# EAGLE design CAN Mirror (EAGLE 6.2)

## Sheet 1 of 4: Processor
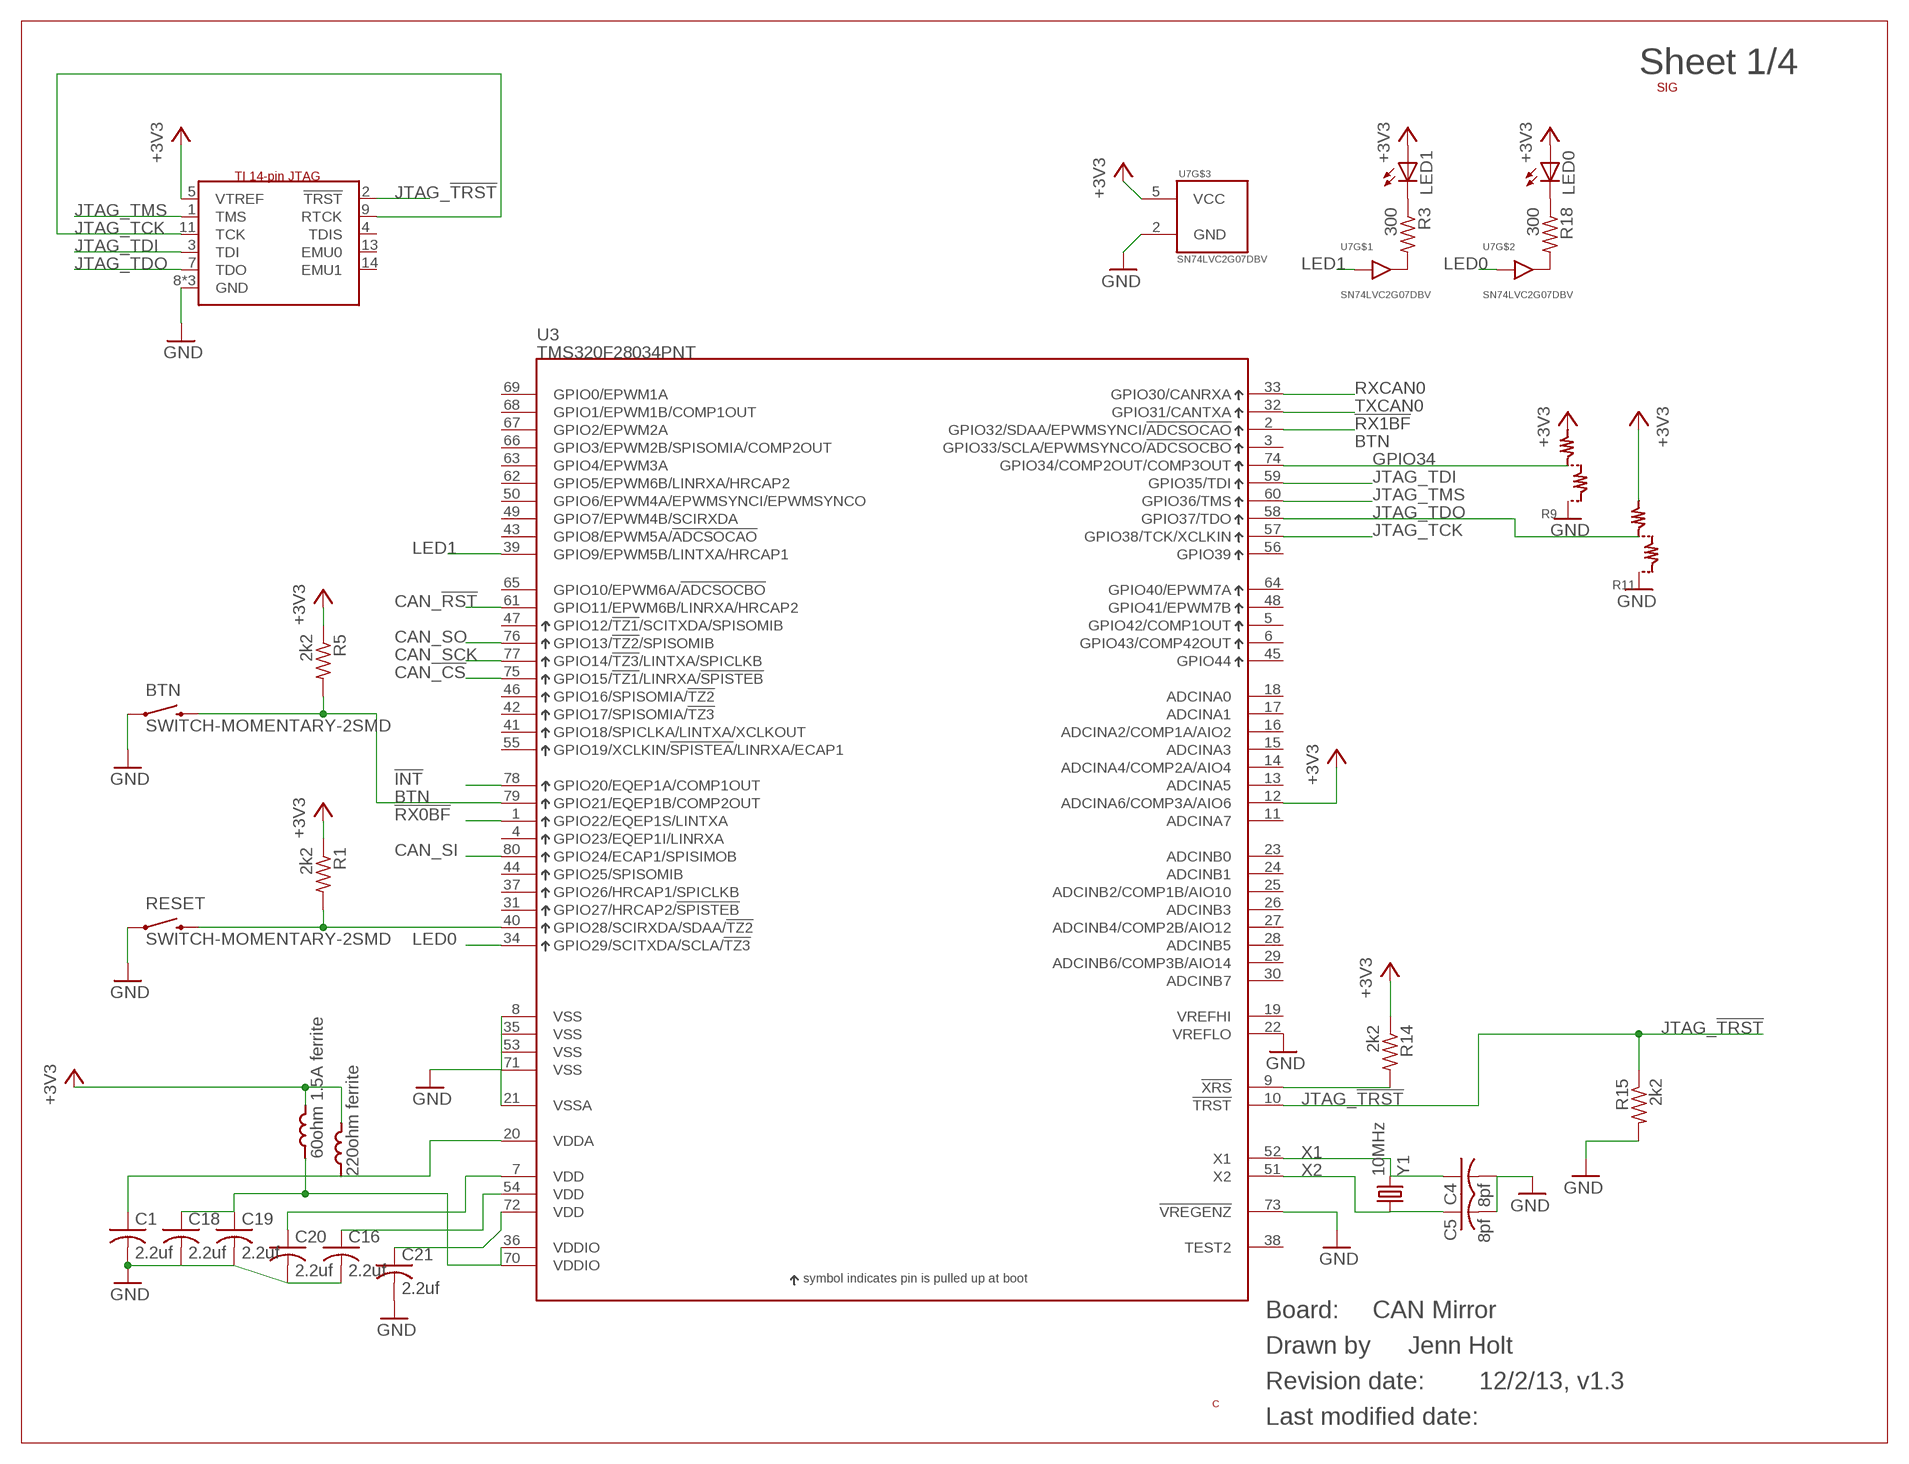
[diagram p0: schematic, sheet 1]

### Parts
BTN  SWITCH-MOMENTARY-2SMD  [TACTILE_SWITCH_SMD]
C1  2.2uf  C-USC0603  [C0603]
C4  8pf  C-USC0603  [C0603]
C5  8pf  C-USC0603  [C0603]
C16  2.2uf  C-USC0603  [C0603]
C18  2.2uf  C-USC0603  [C0603]
C19  2.2uf  C-USC0603  [C0603]
C20  2.2uf  C-USC0603  [C0603]
C21  2.2uf  C-USC0603  [C0603]
L1  60ohm 1.5A ferrite  INDUCTOR_CERAMIC  [R0603]
L2  220ohm ferrite  INDUCTOR_CERAMIC  [R0603]
LED0  LED0603  [LED-0603]
LED1  LED0603  [LED-0603]
R1  2k2  R-US_R0603  [R0603]
R3  300  R-US_R0603  [R0603]
R5  2k2  R-US_R0603  [R0603]
R9  0402-JUMPER-3WAY-0603  [0603-JUMPER-3WAY]
R11  0402-JUMPER-3WAY-0603  [0603-JUMPER-3WAY]
R14  2k2  R-US_R0603  [R0603]
R15  2k2  R-US_R0603  [R0603]
R18  300  R-US_R0603  [R0603]
RESET  SWITCH-MOMENTARY-2SMD  [TACTILE_SWITCH_SMD]
U3  TMS320F28034PNT  [PQFP-80_(S-PQFP-G80)]
U7  SN74LVC2G07DBV  [SOT-6_DDC]
U$1  CURRENT-LOGO-0.5"  [CURRENT-0.5"]
U$6  TI_JTAG14  [PAK100/2500-14]
U$9  CURRENT-FRAME-LETTER-LANDSCAPE  [BLANK]
U$20  SIG  [SIG]
Y1  10MHz  CRYSTAL5X3  [CRYSTAL-SMD-5X3]

### Nets
!INT: U3.78(GPIO20/EQEP1A/COMP1OUT) ; also sheet 3
!RX0BF: U3.1(GPIO22/EQEP1S/LINTXA) ; also sheet 3
!RX1BF: U3.2(GPIO32/SDAA/EPWMSYNCI/!ADCSOCAO) ; also sheet 3
!XRS: R14.2 U3.9(!XRS)
+3V3: L1.2 L2.2 LED0.A LED1.A R1.1 R5.1 R9.B R11.B R14.1 U3.12(ADCINA6/COMP3A/AIO6) U7.5(VCC) U$6.5(VTREF) ; also sheet 2,3,4
BTN: BTN.3 R5.2 U3.79(GPIO21/EQEP1B/COMP2OUT)
CAN_!CS: U3.75(GPIO15/!TZ1!/LINRXA/!SPISTEB) ; also sheet 3
CAN_!RST: U3.61(GPIO11/EPWM6B/LINRXA/HRCAP2) ; also sheet 3
CAN_SCK: U3.77(GPIO14/!TZ3!/LINTXA/SPICLKB) ; also sheet 3
CAN_SI: U3.80(GPIO24/ECAP1/SPISIMOB) ; also sheet 3
CAN_SO: U3.76(GPIO13/!TZ2!/SPISOMIB) ; also sheet 3
GND: BTN.1 C1.2 C4.2 C5.2 C16.2 C18.2 C19.2 C20.2 C21.2 R9.C R11.C R15.2 RESET.1 U3.8(VSS) U3.21(VSSA) U3.22(VREFLO) U3.35(VSS) U3.53(VSS) U3.71(VSS) U3.73(!VREGENZ) U7.2(GND) U$6.8(GND) U$6.10(GND) U$6.12(GND) ; also sheet 2,3,4
GPIO34: R9.A U3.74(GPIO34/COMP2OUT/COMP3OUT)
JTAG_!TRST: R15.1 U3.10(!TRST) U$6.2(!TRST)
JTAG_TCK: U3.57(GPIO38/TCK/XCLKIN) U$6.9(RTCK) U$6.11(TCK)
JTAG_TDI: U3.59(GPIO35/TDI) U$6.3(TDI)
JTAG_TDO: R11.A U3.58(GPIO37/TDO) U$6.7(TDO)
JTAG_TMS: U3.60(GPIO36/TMS) U$6.1(TMS)
LED0: U3.34(GPIO29/SCITXDA/SCLA/!TZ3) U7.3(A)
LED1: U3.39(GPIO9/EPWM5B/LINTXA/HRCAP1) U7.1(A)
N$6: C1.1 L2.1 U3.20(VDDA)
N$7: R18.2 U7.4(Y)
N$9: R3.2 U7.6(Y)
N$13: C18.1 C19.1 L1.1 U3.36(VDDIO) U3.70(VDDIO)
N$14: R1.2 RESET.3 U3.40(GPIO28/SCIRXDA/SDAA/!TZ2)
N$19: C16.1 U3.54(VDD)
N$20: C20.1 U3.7(VDD)
N$21: C21.1 U3.72(VDD)
N$22: LED1.C R3.1
N$27: LED0.C R18.1
RXCAN0: U3.33(GPIO30/CANRXA) ; also sheet 3
TXCAN0: U3.32(GPIO31/CANTXA) ; also sheet 3
X1: C4.1 U3.52(X1) Y1.3
X2: C5.1 U3.51(X2) Y1.1
Unconnected: U3.3(GPIO33/SCLA/EPWMSYNCO/!ADCSOCBO) U3.4(GPIO23/EQEP1I/LINRXA) U3.5(GPIO42/COMP1OUT) U3.6(GPIO43/COMP42OUT) U3.11(ADCINA7) U3.13(ADCINA5) U3.14(ADCINA4/COMP2A/AIO4) U3.15(ADCINA3) U3.16(ADCINA2/COMP1A/AIO2) U3.17(ADCINA1) U3.18(ADCINA0) U3.19(VREFHI) U3.23(ADCINB0) U3.24(ADCINB1) U3.25(ADCINB2/COMP1B/AIO10) U3.26(ADCINB3) U3.27(ADCINB4/COMP2B/AIO12) U3.28(ADCINB5) U3.29(ADCINB6/COMP3B/AIO14) U3.30(ADCINB7) U3.31(GPIO27/HRCAP2/!SPISTEB) U3.37(GPIO26/HRCAP1/SPICLKB) U3.38(TEST2) U3.41(GPIO18/SPICLKA/LINTXA/XCLKOUT) U3.42(GPIO17/SPISOMIA/!TZ3) U3.43(GPIO8/EPWM5A/!ADCSOCAO) U3.44(GPIO25/SPISOMIB) U3.45(GPIO44) U3.46(GPIO16/SPISOMIA/!TZ2) U3.47(GPIO12/!TZ1!/SCITXDA/SPISOMIB) U3.48(GPIO41/EPWM7B) U3.49(GPIO7/EPWM4B/SCIRXDA) U3.50(GPIO6/EPWM4A/EPWMSYNCI/EPWMSYNCO) U3.55(GPIO19/XCLKIN/!SPISTEA!/LINRXA/ECAP1) U3.56(GPIO39) U3.62(GPIO5/EPWM6B/LINRXA/HRCAP2) U3.63(GPIO4/EPWM3A) U3.64(GPIO40/EPWM7A) U3.65(GPIO10/EPWM6A/!ADCSOCBO) U3.66(GPIO3/EPWM2B/SPISOMIA/COMP2OUT) U3.67(GPIO2/EPWM2A) U3.68(GPIO1/EPWM1B/COMP1OUT) U3.69(GPIO0/EPWM1A) U$6.4(TDIS) U$6.13(EMU0) U$6.14(EMU1)

### Notes on the sheet
- CAN Mirror
- Jenn Holt
- 12/2/13, v1.3

## Sheet 2 of 4: Connectors
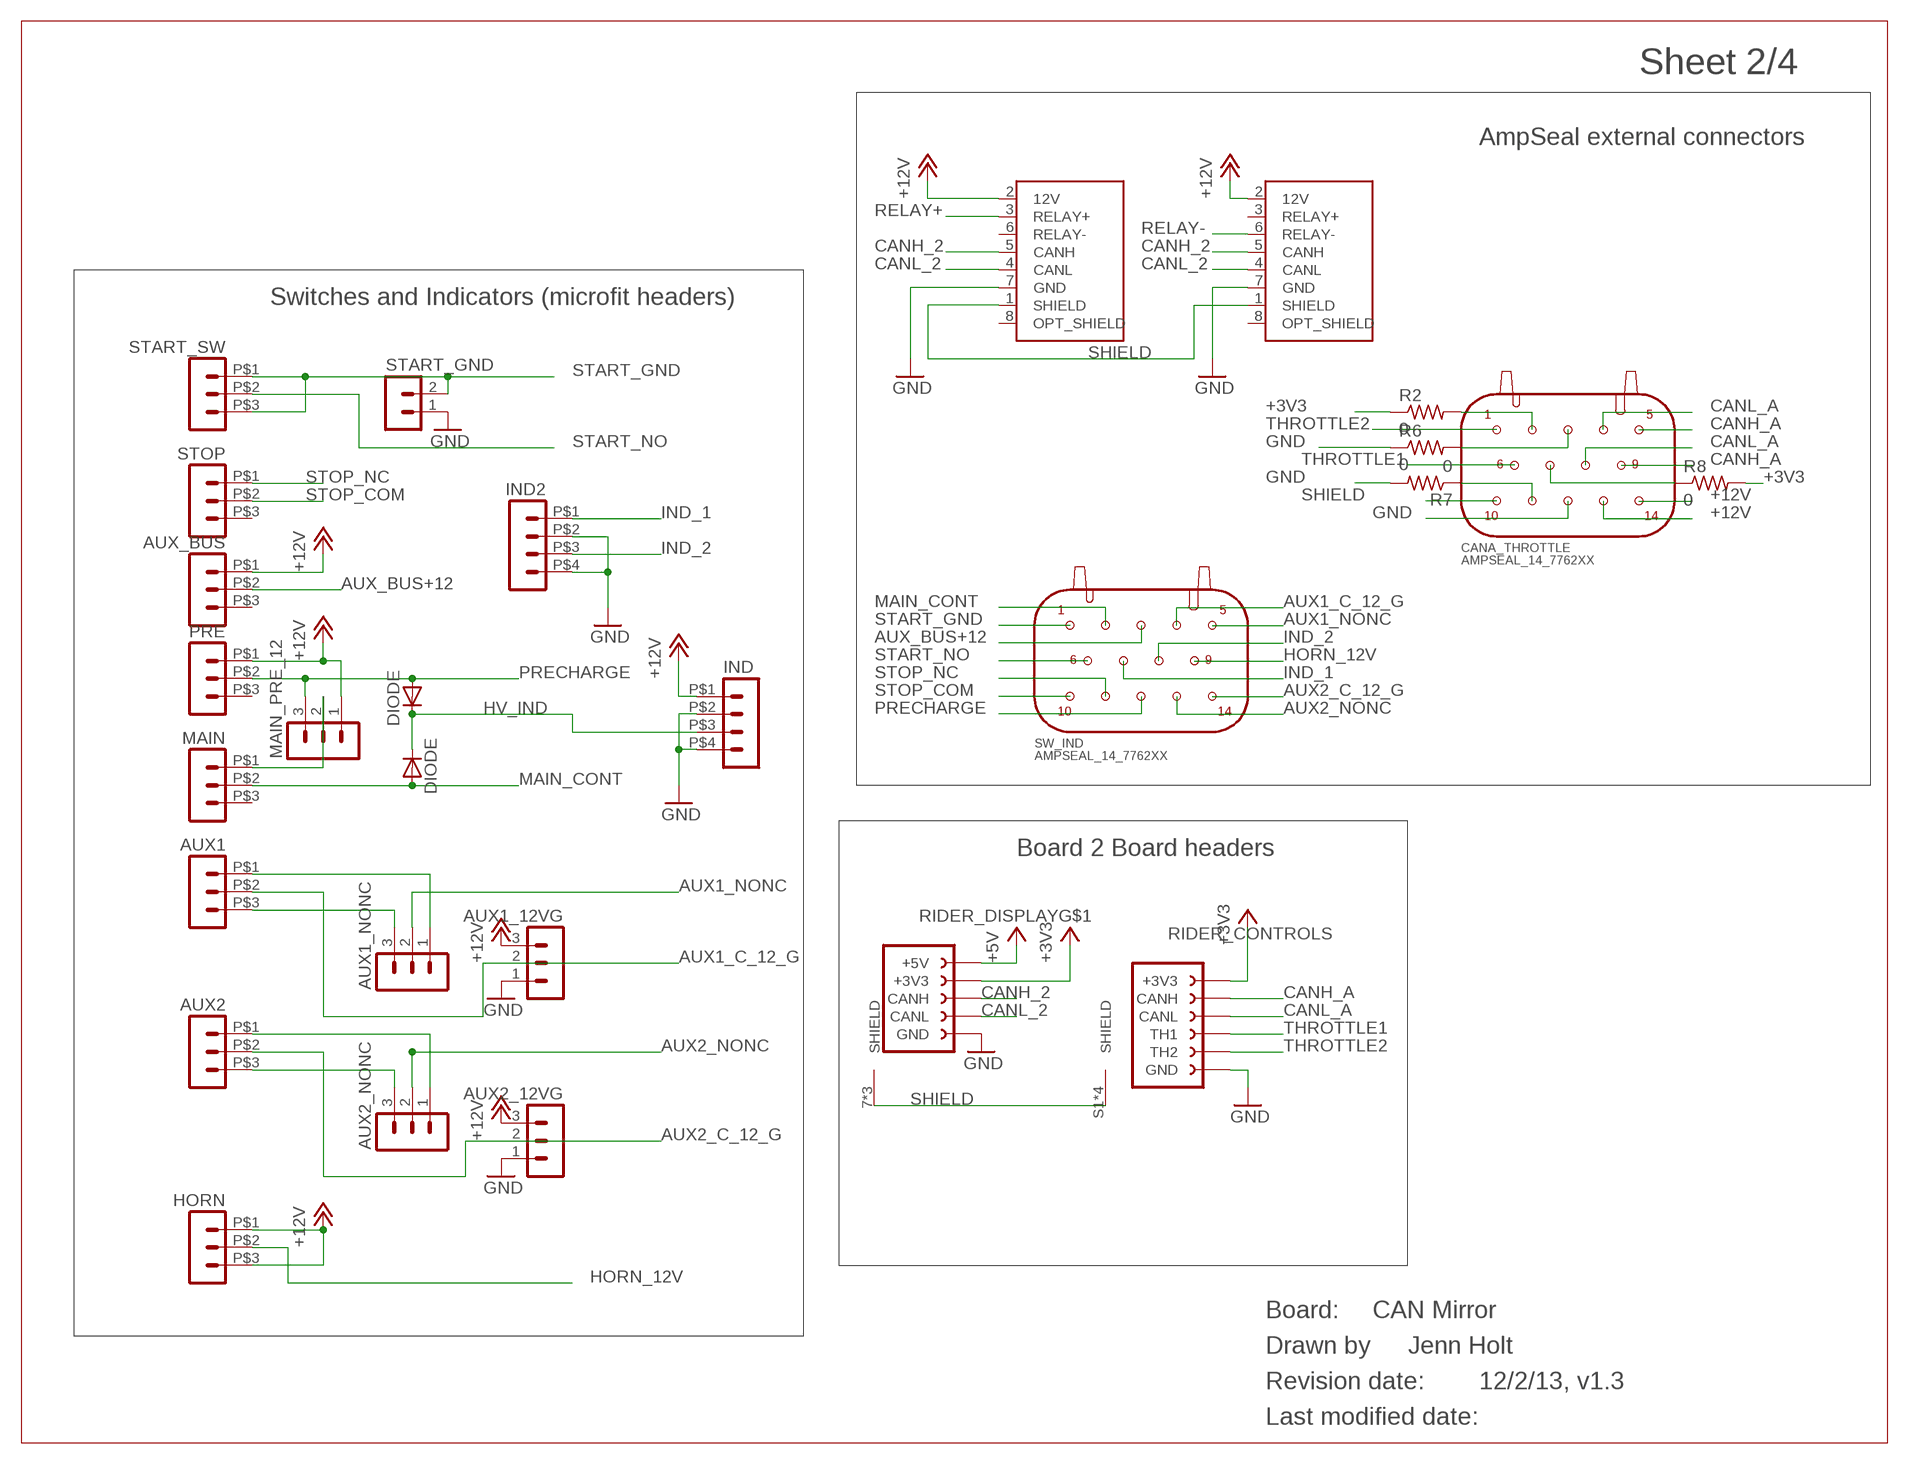
[diagram p1: schematic, sheet 2]

### Parts
AUX1  HEADER_POS3_43650-0321  [43650-0321]
AUX1_12VG  MA03-1  [MA03-1]
AUX1_NONC  MA03-1  [MA03-1]
AUX2  HEADER_POS3_43650-0321  [43650-0321]
AUX2_12VG  MA03-1  [MA03-1]
AUX2_NONC  MA03-1  [MA03-1]
AUX_BUS  HEADER_POS3_43650-0321  [43650-0321]
CANA_THROTTLE  AMPSEAL_14_7762XX  [776262-1_AMPSEAL_14_VERT]
D1  DIODE  [SOD-123]
D5  DIODE  [SOD-123]
HORN  HEADER_POS3_43650-0321  [43650-0321]
IND  HEADER_POS4_43045-0415  [43045-0415]
IND2  HEADER_POS4_43045-0415  [43045-0415]
MAIN  HEADER_POS3_43650-0321  [43650-0321]
MAIN_PRE_12  MA03-1  [MA03-1]
PRE  HEADER_POS3_43650-0321  [43650-0321]
R2  0  R-US_R0603  [R0603]
R6  0  R-US_R0603  [R0603]
R7  0  R-US_R0603  [R0603]
R8  0  R-US_R0603  [R0603]
RIDER_CONTROLS  RIDER_CONTROLS  [RIDER_CONTROLS]
RIDER_DISPLAY  RIDER_DISPLAY  [DISPLAY_BOARD]
START_GND  MA02-1  [MA02-1]
START_SW  HEADER_POS3_43650-0321  [43650-0321]
STOP  HEADER_POS3_43650-0321  [43650-0321]
SW_IND  AMPSEAL_14_7762XX  [776262-1_AMPSEAL_14_VERT]
U$12  CURRENT-FRAME-LETTER-LANDSCAPE  [BLANK]
U$13  CANBUS2VERT  [776276-1_AMPSEAL_8_VERT]
U$14  CANBUS2VERT  [776276-1_AMPSEAL_8_VERT]

### Nets
+3V3: R2.1 R8.2 RIDER_CONTROLS.6(+3V3) RIDER_DISPLAY.2(+3V3) ; also sheet 1,3,4
+5V: RIDER_DISPLAY.1(+5V) ; also sheet 4
+12V: AUX1_12VG.3 AUX2_12VG.3 AUX_BUS.P$1 CANA_THROTTLE.13 CANA_THROTTLE.14 HORN.P$1 HORN.P$3 IND.P$1 MAIN_PRE_12.1 PRE.P$1 U$13.2(12V) U$14.2(12V) ; also sheet 4
AUX1_C_12_G: AUX1.P$2 AUX1_12VG.2 SW_IND.4
AUX1_NONC: AUX1_NONC.2 SW_IND.5
AUX2_C_12_G: AUX2.P$2 AUX2_12VG.2 SW_IND.14
AUX2_NONC: AUX2_NONC.2 SW_IND.13
AUX_BUS+12: AUX_BUS.P$2 SW_IND.3
CANH_2: RIDER_DISPLAY.4(CANH) U$13.5(CANH) U$14.5(CANH) ; also sheet 3
CANH_A: CANA_THROTTLE.5 CANA_THROTTLE.9 RIDER_CONTROLS.5(CANH) ; also sheet 3
CANL_2: RIDER_DISPLAY.3(CANL) U$13.4(CANL) U$14.4(CANL) ; also sheet 3
CANL_A: CANA_THROTTLE.4 CANA_THROTTLE.8 RIDER_CONTROLS.4(CANL) ; also sheet 3
GND: AUX1_12VG.1 AUX2_12VG.1 CANA_THROTTLE.12 IND2.P$2 IND2.P$4 IND.P$2 IND.P$4 R6.1 R7.2 RIDER_CONTROLS.1(GND) RIDER_DISPLAY.5(GND) RIDER_DISPLAY.6(GND) START_GND.1 U$13.7(GND) U$14.7(GND) ; also sheet 1,3,4
HORN_12V: HORN.P$2 SW_IND.9
HV_IND: D1.C D5.C IND.P$3
IND_1: IND2.P$1 SW_IND.7
IND_2: IND2.P$3 SW_IND.8
MAIN_CONT: D5.A MAIN.P$2 SW_IND.2
N$3: AUX1.P$1 AUX1_NONC.1
N$5: AUX1.P$3 AUX1_NONC.3
N$8: AUX2.P$1 AUX2_NONC.1
N$10: AUX2.P$3 AUX2_NONC.3
N$12: MAIN.P$1 MAIN_PRE_12.2
N$15: CANA_THROTTLE.2 R2.2
N$16: CANA_THROTTLE.3 R6.2
N$17: CANA_THROTTLE.11 R7.1
N$18: CANA_THROTTLE.7 R8.1
PRECHARGE: D1.A MAIN_PRE_12.3 PRE.P$2 SW_IND.12
RELAY+: U$13.3(RELAY+) ; also sheet 3
RELAY-: U$14.6(RELAY-) ; also sheet 3
SHIELD: CANA_THROTTLE.10 RIDER_CONTROLS.S1(SHIELD) RIDER_CONTROLS.S2(SHIELD) RIDER_CONTROLS.S3(SHIELD) RIDER_CONTROLS.S4(SHIELD) RIDER_DISPLAY.7(SHIELD) RIDER_DISPLAY.8(SHIELD) RIDER_DISPLAY.9(SHIELD) U$13.1(SHIELD) U$14.1(SHIELD) ; also sheet 4
START_GND: START_GND.2 START_SW.P$1 START_SW.P$3 SW_IND.1
START_NO: START_SW.P$2 SW_IND.6
STOP_COM: STOP.P$2 SW_IND.10
STOP_NC: STOP.P$1 SW_IND.11
THROTTLE1: CANA_THROTTLE.6 RIDER_CONTROLS.3(TH1)
THROTTLE2: CANA_THROTTLE.1 RIDER_CONTROLS.2(TH2)
Unconnected: AUX_BUS.P$3 MAIN.P$3 PRE.P$3 STOP.P$3 U$13.6(RELAY-) U$13.8(OPT_SHIELD) U$14.3(RELAY+) U$14.8(OPT_SHIELD)

### Notes on the sheet
- AmpSeal external connectors
- Switches and Indicators (microfit headers)
- Board 2 Board headers
- CAN Mirror
- Jenn Holt
- 12/2/13, v1.3

## Sheet 3 of 4: CAN tranceivers
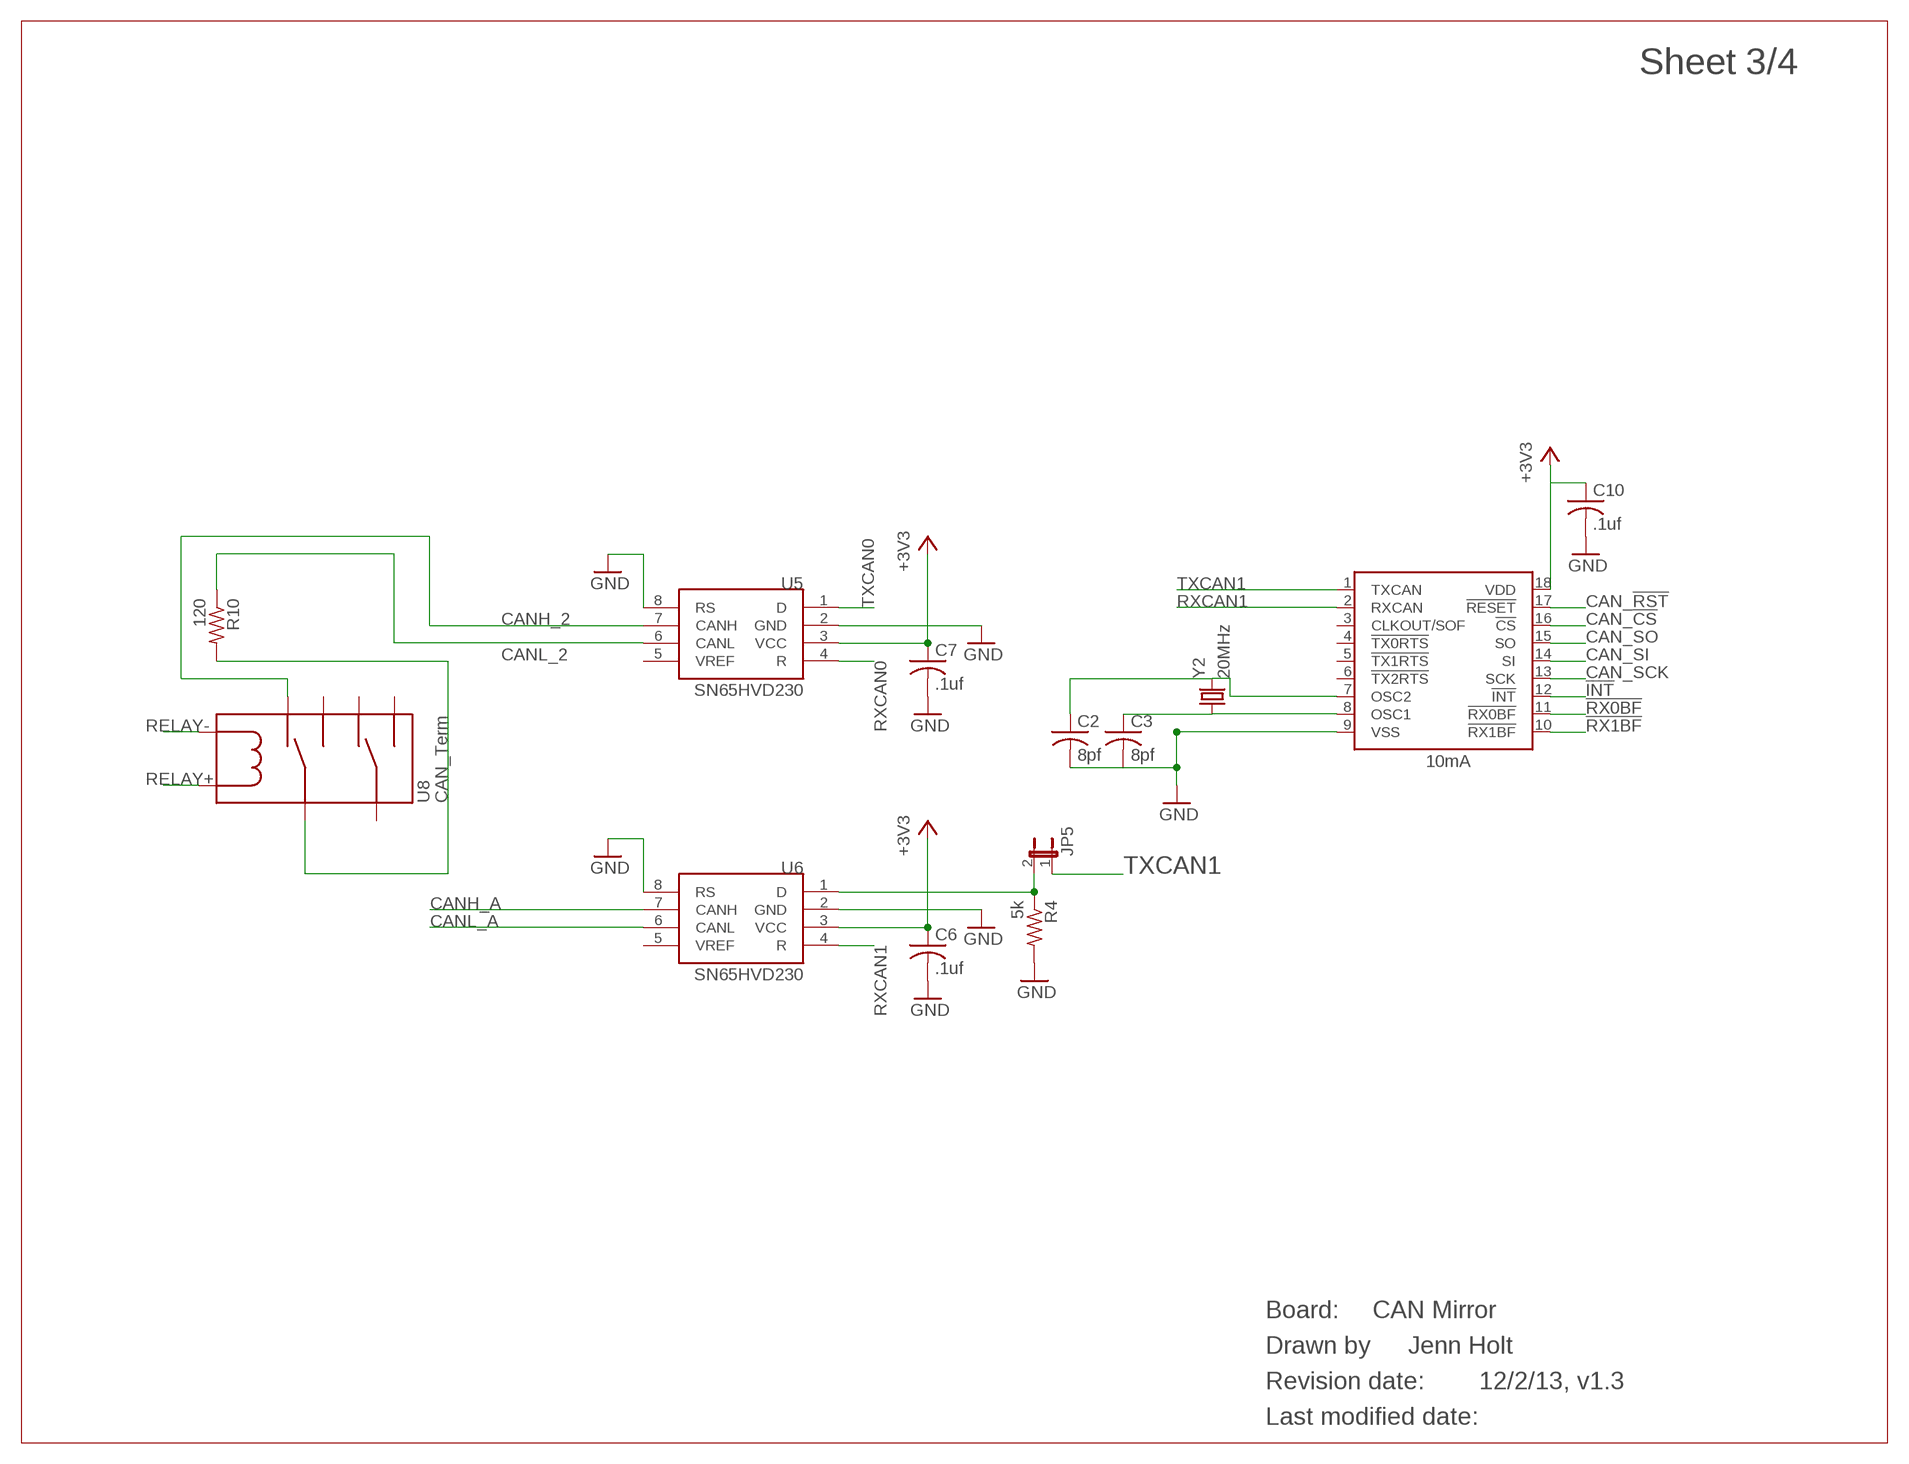
[diagram p2: schematic, sheet 3]

### Parts
C2  8pf  C-USC0603  [C0603]
C3  8pf  C-USC0603  [C0603]
C6  .1uf  C-USC0603  [C0603]
C7  .1uf  C-USC0603  [C0603]
C10  .1uf  C-USC0603  [C0603]
JP5  JUMPER-2SMD-NO  [SJ_2S-NO]
R4  5k  R-US_R0603  [R0603]
R10  120  R-US_R0603  [R0603]
U4  MCP2515  [SO-18W]
U5  SN65HVD230  [SOIC8]
U6  SN65HVD230  [SOIC8]
U8  CAN_Term  IM_RELAY  [IM_RELAY]
U$16  CURRENT-FRAME-LETTER-LANDSCAPE  [BLANK]
Y2  20MHz  CRYSTAL5X3  [CRYSTAL-SMD-5X3]

### Nets
!INT: U4.12(!INT) ; also sheet 1
!RX0BF: U4.11(!RX0BF) ; also sheet 1
!RX1BF: U4.10(!RX1BF) ; also sheet 1
+3V3: C6.1 C7.1 C10.1 U4.18(VDD) U5.3(VCC) U6.3(VCC) ; also sheet 1,2,4
CAN_!CS: U4.16(!CS) ; also sheet 1
CAN_!RST: U4.17(!RESET) ; also sheet 1
CAN_SCK: U4.13(SCK) ; also sheet 1
CAN_SI: U4.14(SI) ; also sheet 1
CAN_SO: U4.15(SO) ; also sheet 1
CANH_2: U5.7(CANH) U8.2(NC1) ; also sheet 2
CANH_A: U6.7(CANH) ; also sheet 2
CANL_2: R10.1 U5.6(CANL) ; also sheet 2
CANL_A: U6.6(CANL) ; also sheet 2
GND: C2.2 C3.2 C6.2 C7.2 C10.2 R4.2 U4.9(VSS) U5.2(GND) U5.8(RS) U6.2(GND) U6.8(RS) ; also sheet 1,2,4
N$1: C3.1 U4.8(OSC1) Y2.1
N$2: C2.1 U4.7(OSC2) Y2.3
N$4: JP5.2 R4.1 U6.1(D)
N$11: R10.2 U8.3(COM1)
RELAY+: U8.1(C1) ; also sheet 2
RELAY-: U8.8(C2) ; also sheet 2
RXCAN0: U5.4(R) ; also sheet 1
RXCAN1: U4.2(RXCAN) U6.4(R)
TXCAN0: U5.1(D) ; also sheet 1
TXCAN1: JP5.1 U4.1(TXCAN)
Unconnected: U4.3(CLKOUT/SOF) U4.4(!TX0RTS) U4.5(!TX1RTS) U4.6(!TX2RTS) U5.5(VREF) U6.5(VREF) U8.4(NO1) U8.5(NO2) U8.6(COM2) U8.7(NC2)

### Notes on the sheet
- 10mA
- CAN Mirror
- Jenn Holt
- 12/2/13, v1.3

## Sheet 4 of 4: Power
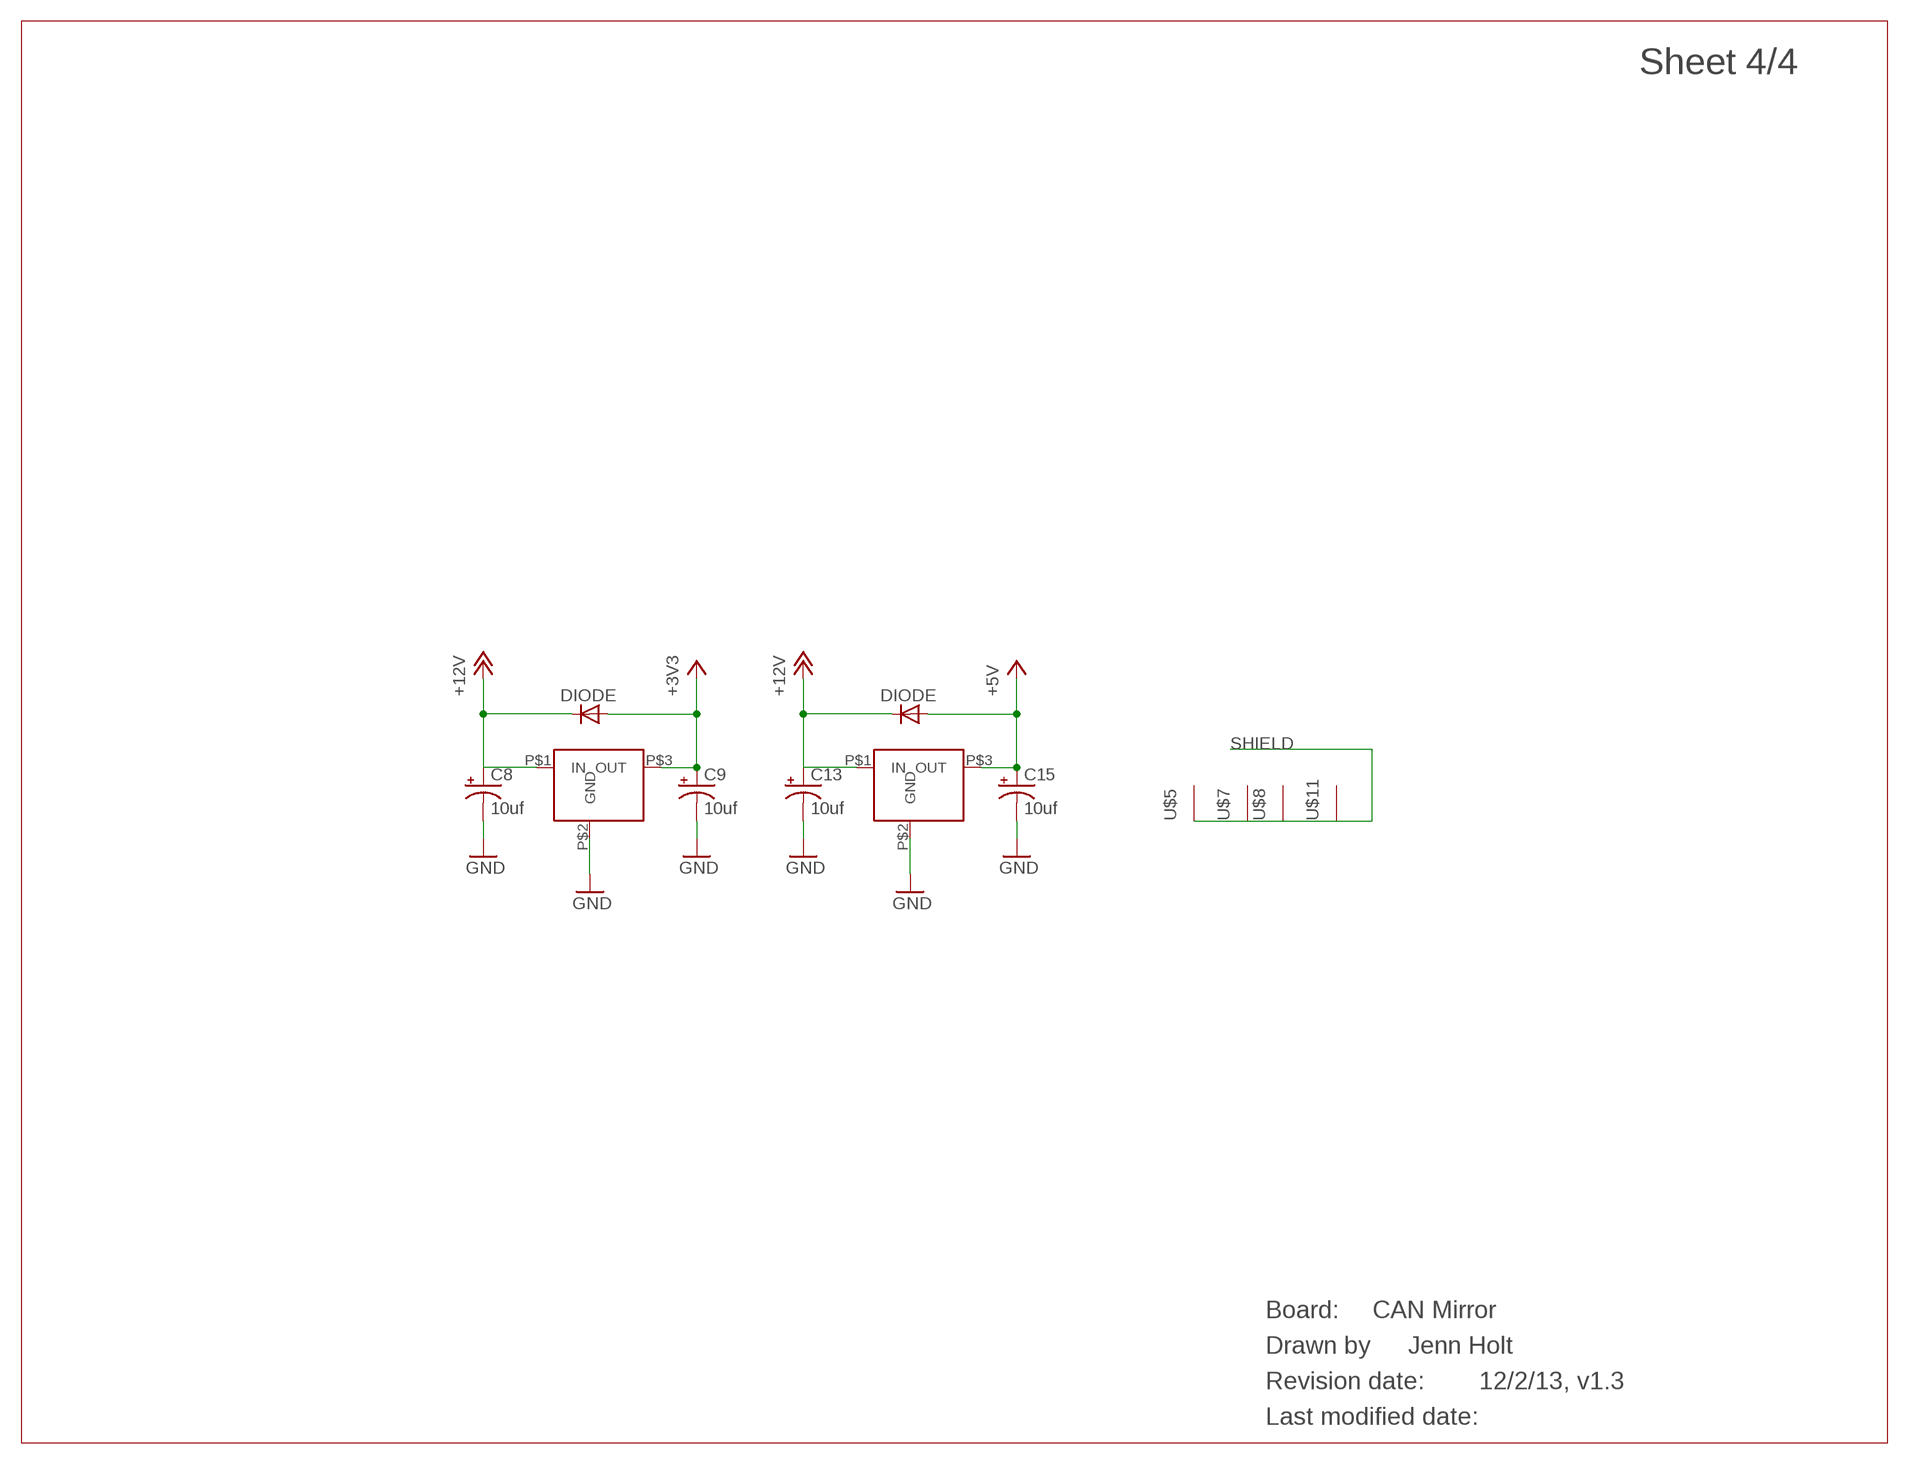
[diagram p3: schematic, sheet 4]

### Parts
C8  10uf  CPOL-USCT3216  [CT3216]
C9  10uf  CPOL-USCT3216  [CT3216]
C13  10uf  CPOL-USCT3216  [CT3216]
C15  10uf  CPOL-USCT3216  [CT3216]
D3  DIODE  [SOD-123]
D4  DIODE  [SOD-123]
U1  RECOM_DCDC3v3  RECOM_DCDC  [INNOLINE-SIP]
U2  RECOM_DCDC5v  RECOM_DCDC  [INNOLINE-SIP]
U$5  MOUNT_HOLE  [MOUNT_HOLE_125]
U$7  MOUNT_HOLE  [MOUNT_HOLE_125]
U$8  MOUNT_HOLE  [MOUNT_HOLE_125]
U$11  MOUNT_HOLE  [MOUNT_HOLE_125]
U$17  CURRENT-FRAME-LETTER-LANDSCAPE  [BLANK]

### Nets
+3V3: C9.+ D4.A U1.P$3(OUT) ; also sheet 1,2,3
+5V: C15.+ D3.A U2.P$3(OUT) ; also sheet 2
+12V: C8.+ C13.+ D3.C D4.C U1.P$1(IN) U2.P$1(IN) ; also sheet 2
GND: C8.- C9.- C13.- C15.- U1.P$2(GND) U2.P$2(GND) ; also sheet 1,2,3
SHIELD: U$5.P$1 U$7.P$1 U$8.P$1 U$11.P$1 ; also sheet 2

### Notes on the sheet
- CAN Mirror
- Jenn Holt
- 12/2/13, v1.3

## Library data of the parts
AUX1 AUX2 AUX_BUS HORN MAIN PRE START_SW STOP = con-molex-micro-fit-3_0:HEADER_POS3_?: Molex - Micro-Fit 3.0 Series connector, 3.00mm (0.118") pitch header, 3 positions.; PARTNO: 43650-0321
AUX1_12VG AUX1_NONC AUX2_12VG AUX2_NONC MAIN_PRE_12 = con-lstb:MA03-1: PIN HEADER; OC_FARNELL: unknown; OC_NEWARK: unknown; PARTNO: 9-146274-0-20
BTN RESET = SparkFun:SWITCH-MOMENTARY-2; PARTNO: RS-187R05A2-DS MT RT
C1 C16 C18-C21 = rcl:C-US: CAPACITOR, American symbol; PARTNO: GRM188R61E225KA12D
C2-C5 = rcl:C-US: CAPACITOR, American symbol; PARTNO: C1608C0G1H080D080AA
C6 C7 C10 = rcl:C-US: CAPACITOR, American symbol; PARTNO: C1608X7R1E104K080AA
C8 C9 C13 C15 = rcl:CPOL-US: POLARIZED CAPACITOR, American symbol; PARTNO: T491A106M020AT
CANA_THROTTLE SW_IND = TE-Jenn:AMPSEAL_14_7762XX; PARTNO: 776262-1
D1 D3-D5 = jenn:DIODE; PARTNO: MBR0540T1G
IND IND2 = con-molex-micro-fit-3_0:HEADER_POS4_?: Molex - Micro-Fit 3.0 Series connector, 3.00mm (0.118") pitch header, 4 positions.; PARTNO: 43045-0415
JP5 = SparkFun:JUMPER-2: Jumper Basic 0.1" spaced jumper. Use with breakaway headers.
L1 = jenn:INDUCTOR; PARTNO: BKP1608HS600-T
L2 = jenn:INDUCTOR; PARTNO: MH1608-221Y
LED0 LED1 = SparkFun:LED: LEDs Standard schematic elements and footprints for 5mm, 3mm, 1206, and 0603 sized LEDs. 5mm - Spark Fun Electronics SKU : COM-00529 (and others); PARTNO: HSMH-C190
R1 R5 R14 R15 = rcl:R-US_: RESISTOR, American symbol; PARTNO: RC0603FR-102K2L
R2 R6-R8 = rcl:R-US_: RESISTOR, American symbol; PARTNO: CRCW06030000Z0EA
R3 R18 = rcl:R-US_: RESISTOR, American symbol; PARTNO: ERJ-3GEYJ301V
R4 = rcl:R-US_: RESISTOR, American symbol; PARTNO: ERJ-3EKF4701V
R9 R11 = Passives:0402-JUMPER-3WAY: A 3-way solder jumper in 0402 size.
R10 = rcl:R-US_: RESISTOR, American symbol; PARTNO: RC0805FR-07120RL
RIDER_CONTROLS = mirror_special:RIDER_CONTROLS; PARTNO: 534237-4
RIDER_DISPLAY = mirror_special:RIDER_DISPLAY; PARTNO: 534237-4
START_GND = jenn:MA02-1: PIN HEADER; PARTNO: 9-146274-0-20
U1 = jenn:RECOM_DCDC: RECOM Innoline 78xx series dc-dc converters 1A output part number R-78xxx-1.0 where xxx=1.8,2.5,3.3,5.0 (Volts); PARTNO: R-78C3.3-1.0
U2 = jenn:RECOM_DCDC: RECOM Innoline 78xx series dc-dc converters 1A output part number R-78xxx-1.0 where xxx=1.8,2.5,3.3,5.0 (Volts); PARTNO: R-78C5.0-1.0
U3 = TI:TMS320F28034: TMS320F2803x (Piccolo) 32-Bit High-Efficiency MCU Datasheet: http://www.ti.com/lit/ds/sprs584j/sprs584j.pdf Product page: http://www.ti.com/product/tms320f28034; PARTNO: TMS320F28035PNT
U4 = microchip:MCP2515; PARTNO: MCP2515-I/SO
U5 U6 = BMC components:SN65HVD230; PARTNO: SN65HVD230D
U7 = TI_jenn:SN74LVC2G07; PARTNO: SN74LVC2G07DBVR
U8 = TE-Jenn:IM_RELAY: DPDT IM style relay.; PARTNO: IM26GR
U$1 = Logos:CURRENT-LOGO
U$5 U$7 U$8 U$11 = Generic connectors:MOUNT_HOLE: Mounting Hole with connectable pad. Useful for shield connections.
U$6 = texas:TI_JTAG14; PARTNO: 67996-114HLF
U$9 U$12 U$16 U$17 = Frames-v6:CURRENT-FRAME-LETTER-LANDSCAPE
U$13 U$14 = TE-Jenn:CANBUS2; PARTNO: 1-776276-1
U$20 = jenn:SIG
Y1 = SparkFun:CRYSTAL: Crystals Various standard crystals. Proven footprints. Spark Fun Electronics SKU : COM-00534; PARTNO: ECS-100-8-30B-CKM
Y2 = SparkFun:CRYSTAL: Crystals Various standard crystals. Proven footprints. Spark Fun Electronics SKU : COM-00534; PARTNO: ECS-200-8-30B-CKM

## Board
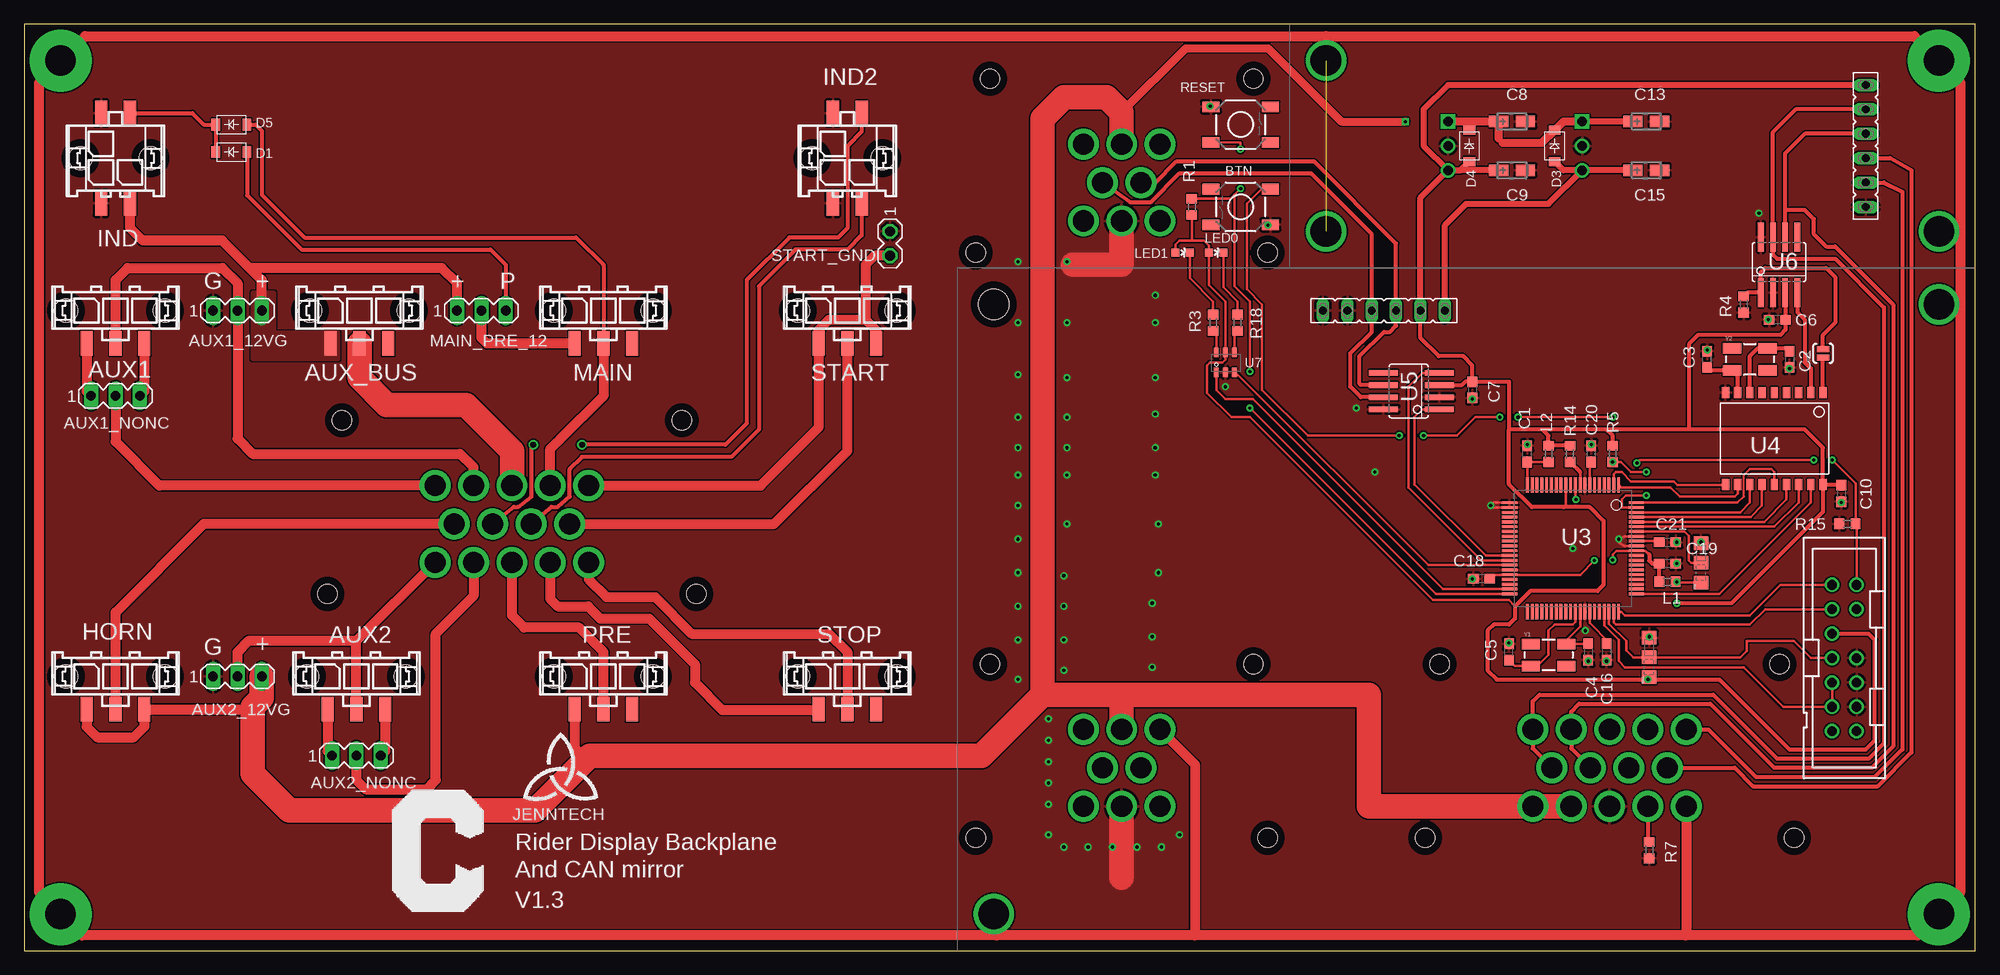
[diagram p4: board, top side]
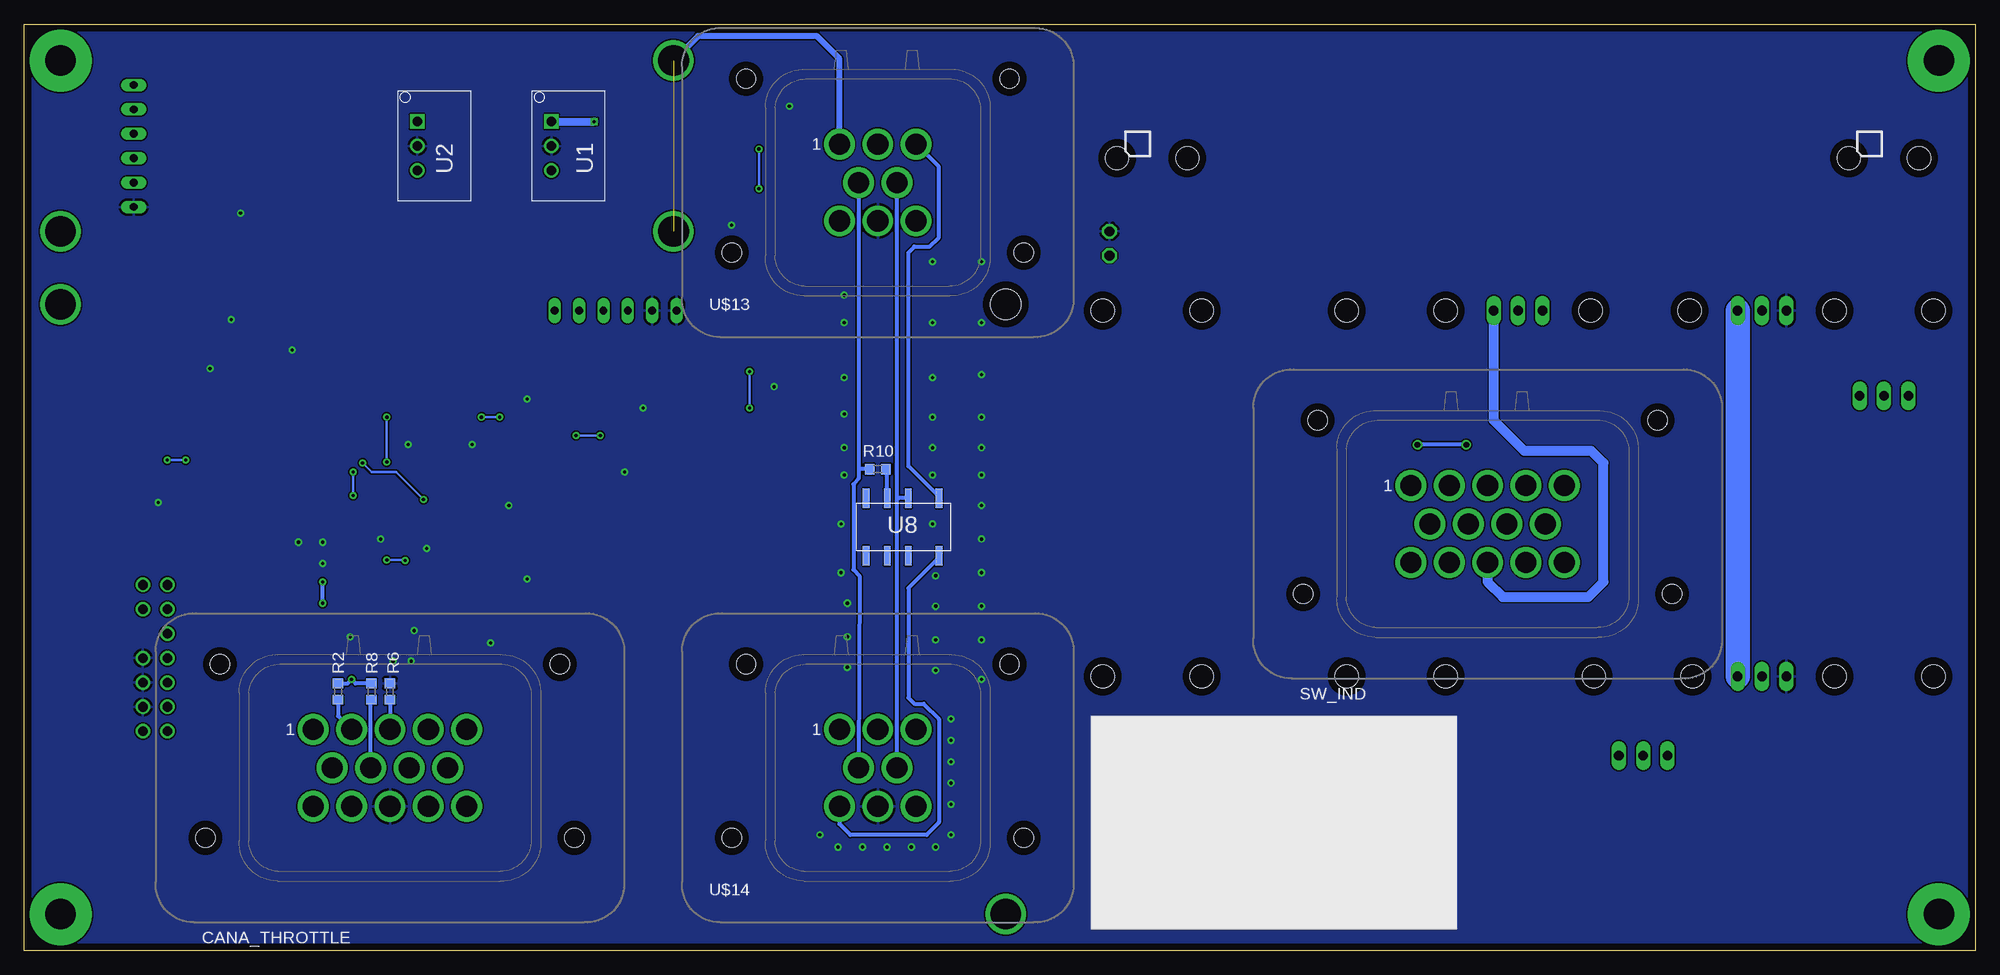
[diagram p5: board, bottom side, seen from below]

Size 203.2 x 96.52 mm. Coordinates in mm from the lower left corner, seen from the top.
Outline: 0,0 203.2,0 203.2,96.52 0,96.52 0,0
Copper layers (1*16): Top 0.035mm / dielectric 1.5mm / Bottom 0.035mm
Design rules: minimum track width 6mil, minimum drill 13mil, track to track 6mil, track to pad 6mil, pad to pad 6mil, via to via 6mil, smd to smd 0mil, copper to edge 30mil, drill to drill 8mil, minimum pad ring 10mil, minimum via ring 8mil, stop-mask expansion 4mil, vias tented up to drill 13mil, thermal gap 10mil

### Footprints (pad centres in the part's own frame; a part is rotated, then mirrored left to right if it is on the bottom)
43650-0321 = smd 1.27 x 2.54: P$1 3,3.43; P$2 0,3.43; P$3 -3,3.43 | hole 2.41: 5.15,0; -5.15,0
MA03-1 = drill 1.016 long: 1 -2.54,0; 2 0,0; 3 2.54,0
TACTILE_SWITCH_SMD = smd 1.8 x 1.1: 1 -3.1,1.85; 2 3.1,1.85; 3 -3.1,-1.85; 4 3.1,-1.85
C0603 = smd 1.1 x 1: 1 -0.85,0; 2 0.85,0
CT3216 = smd 2 x 1.2: + -1.4,0; - 1.4,0
776262-1_AMPSEAL_14_VERT = drill 2.2: 1 -8,4; 2 -4,4; 3 0,4; 4 4,4; 5 8,4; 6 -6,0; 7 -2,0; 8 2,0; 9 6,0; 10 -8,-4; 11 -4,-4; 12 0,-4; 13 4,-4; 14 8,-4 | hole 2: -17.7,10.8; 17.7,10.8; -19.2,-7.3; 19.2,-7.3
SOD-123 = smd 0.91 x 1.22: A -1.635,0; C 1.635,0
43045-0415 = smd 1.27 x 2.54: P$1 1.5,-4.7; P$2 -1.5,-4.7; P$3 1.5,4.7; P$4 -1.5,4.7 | hole 2.41: -3.65,0; 3.65,0
SJ_2S-NO = smd 0.635 x 1.27: 1 -0.45,0; 2 0.45,0
R0603 = smd 1 x 1.1: 1 -0.85,0; 2 0.85,0
LED-0603 = smd 0.8 x 0.8: A 0,-0.75; C 0,0.75
0603-JUMPER-3WAY = smd 1.4 x 1.5: A 1.025,0; B -1.025,0; C 3.075,0
RIDER_CONTROLS = drill 0.813 long: 1 60.008,6.35; 2 60.008,8.89; 3 60.008,11.43; 4 60.008,13.97; 5 60.008,16.51; 6 60.008,19.05 | drill 3.2: S1 3.81,3.81; S2 67.627,3.81; S3 67.627,21.59; S4 3.81,21.59
DISPLAY_BOARD = drill 0.813 long: 1 50.8,66.675; 2 48.26,66.675; 3 45.72,66.675; 4 43.18,66.675; 5 40.64,66.675; 6 38.1,66.675 | drill 3.2: 7 3.81,3.81; 8 102.235,3.81; 9 102.235,67.31 | hole 3.2: 3.81,67.31
MA02-1 = drill 1.016 pad 1.524 octagon: 1 -2.54,0; 2 0,0
INNOLINE-SIP = drill 1 square: P$1 -2.54,0 | drill 1: P$2 0,0; P$3 2.54,0
PQFP-80_(S-PQFP-G80) = smd 0.3 x 1.6: 1 -4.75,-6.6; 2 -4.25,-6.6; 3 -3.75,-6.6; 4 -3.25,-6.6; 5 -2.75,-6.6; 6 -2.25,-6.6; 7 -1.75,-6.6; 8 -1.25,-6.6; 9 -0.75,-6.6; 10 -0.25,-6.6; 11 0.25,-6.6; 12 0.75,-6.6; 13 1.25,-6.6; 14 1.75,-6.6; 15 2.25,-6.6; 16 2.75,-6.6; 17 3.25,-6.6; 18 3.75,-6.6; 19 4.25,-6.6; 20 4.75,-6.6; 41 4.75,6.6; 42 4.25,6.6; 43 3.75,6.6; 44 3.25,6.6; 45 2.75,6.6; 46 2.25,6.6; 47 1.75,6.6; 48 1.25,6.6; 49 0.75,6.6; 50 0.25,6.6; 51 -0.25,6.6; 52 -0.75,6.6; 53 -1.25,6.6; 54 -1.75,6.6; 55 -2.25,6.6; 56 -2.75,6.6; 57 -3.25,6.6; 58 -3.75,6.6; 59 -4.25,6.6; 60 -4.75,6.6 | smd 1.6 x 0.3: 21 6.6,-4.75; 22 6.6,-4.25; 23 6.6,-3.75; 24 6.6,-3.25; 25 6.6,-2.75; 26 6.6,-2.25; 27 6.6,-1.75; 28 6.6,-1.25; 29 6.6,-0.75; 30 6.6,-0.25; 31 6.6,0.25; 32 6.6,0.75; 33 6.6,1.25; 34 6.6,1.75; 35 6.6,2.25; 36 6.6,2.75; 37 6.6,3.25; 38 6.6,3.75; 39 6.6,4.25; 40 6.6,4.75; 61 -6.6,4.75; 62 -6.6,4.25; 63 -6.6,3.75; 64 -6.6,3.25; 65 -6.6,2.75; 66 -6.6,2.25; 67 -6.6,1.75; 68 -6.6,1.25; 69 -6.6,0.75; 70 -6.6,0.25; 71 -6.6,-0.25; 72 -6.6,-0.75; 73 -6.6,-1.25; 74 -6.6,-1.75; 75 -6.6,-2.25; 76 -6.6,-2.75; 77 -6.6,-3.25; 78 -6.6,-3.75; 79 -6.6,-4.25; 80 -6.6,-4.75
SO-18W = smd 0.762 x 1.143: 1 -5.08,-4.788; 2 -3.81,-4.788; 3 -2.54,-4.788; 4 -1.27,-4.788; 5 0,-4.788; 6 1.27,-4.788; 7 2.54,-4.788; 8 3.81,-4.788; 9 5.08,-4.788; 10 5.08,4.788; 11 3.81,4.788; 12 2.54,4.788; 13 1.27,4.788; 14 0,4.788; 15 -1.27,4.788; 16 -2.54,4.788; 17 -3.81,4.788; 18 -5.08,4.788
SOIC8 = smd 0.6 x 3: 1 0.5,-2.9; 2 1.77,-2.9; 3 3.04,-2.9; 4 4.31,-2.9; 5 4.31,2.9; 6 3.04,2.9; 7 1.77,2.9; 8 0.5,2.9
SOT-6_DDC = smd 0.5 x 1: 1 -0.95,-1.05; 2 0,-1.05; 3 0.95,-1.05; 4 0.95,1.05; 5 0,1.05; 6 -0.95,1.05
IM_RELAY = smd 0.7 x 2: 1 -3.2,-3; 2 0,-3; 3 2.2,-3; 4 4.4,-3; 5 4.4,3; 6 2.2,3; 7 0,3; 8 -3.2,3
MOUNT_HOLE_125 = drill 3.2 pad 6.452: P$1 0,0
PAK100/2500-14 = drill 1 pad 1.422: 1 -7.62,-1.27; 2 -7.62,1.27; 3 -5.08,-1.27; 4 -5.08,1.27; 5 -2.54,-1.27; 7 0,-1.27; 8 0,1.27; 9 2.54,-1.27; 10 2.54,1.27; 11 5.08,-1.27; 12 5.08,1.27; 13 7.62,-1.27; 14 7.62,1.27
776276-1_AMPSEAL_8_VERT = drill 2.2: 1 -4,4; 2 0,4; 3 4,4; 4 -2,0; 5 2,0; 6 -4,-4; 7 0,-4; 8 4,-4 | hole 2: -13.7,10.8; 13.7,10.8; -15.2,-7.3; 15.2,-7.3
CRYSTAL-SMD-5X3 = smd 1.9 x 1.1: 1 -1.85,-1.15; 2 1.85,-1.15; 3 1.85,1.15; 4 -1.85,1.15

### Placement (x,y rotation side)
AUX1  9.53,66.67 180 top
AUX1_12VG  22.23,66.67 0 top
AUX1_NONC  9.53,57.78 0 top
AUX2  34.61,28.57 180 top
AUX2_12VG  22.23,28.57 0 top
AUX2_NONC  34.61,20.32 0 top
AUX_BUS  34.92,66.67 180 top
BTN  126.68,77.47 180 top
C1  156.53,51.75 90 top
C2  183.83,61.59 270 top
C3  175.26,61.59 90 top
C4  162.88,31.11 270 top
C5  154.62,31.11 90 top
C6  182.56,65.72 180 top
C7  150.81,58.42 270 top
C8  154.94,86.36 0 top
C9  154.94,81.28 0 top
C10  189.23,47.62 270 top
C13  168.91,86.36 0 top
C15  168.91,81.28 0 top
C16  164.78,31.11 270 top
C18  151.76,38.73 180 top
C19  171.13,40.32 0 top
C20  163.19,51.75 90 top
C21  171.13,42.55 0 top
CANA_THROTTLE  165.1,19.05 0 bottom
D1  21.59,83.19 180 top
D3  159.38,83.82 90 top
D4  150.5,83.82 90 top
D5  21.59,86.04 180 top
HORN  9.53,28.57 180 top
IND  9.53,82.55 0 top
IND2  85.72,82.55 0 top
JP5  187.32,62.23 90 top
L1  171.13,38.42 0 top
L2  158.75,51.75 90 top
LED0  124.14,72.71 270 top
LED1  120.65,72.71 270 top
MAIN  60.33,66.67 180 top
MAIN_PRE_12  47.62,66.67 0 top
PRE  60.33,28.57 180 top
R1  121.6,77.47 90 top
R2  170.5,26.99 270 bottom
R3  123.83,65.41 270 top
R4  179.07,67.31 270 top
R5  165.42,51.75 270 top
R6  165.1,26.99 270 bottom
R7  169.23,10.48 270 top
R8  167,26.99 90 bottom
R9  174.62,39.37 90 top
R10  114.3,50.16 0 bottom
R11  169.23,29.53 90 top
R14  160.97,51.75 270 top
R15  189.87,44.45 180 top
R18  126.36,65.41 270 top
RESET  126.68,86.04 0 top
RIDER_CONTROLS  131.76,71.12 0 top
RIDER_DISPLAY  97.16,0 0 top
START_GND  90.17,72.39 270 top
START_SW  85.72,66.67 180 top
STOP  85.72,28.57 180 top
SW_IND  50.8,44.45 0 bottom
U1  148.27,83.82 270 bottom
U2  162.24,83.82 270 bottom
U3  161.29,41.91 180 top
U4  182.25,53.34 180 top
U5  144.46,55.88 90 top
U6  180.34,71.44 0 top
U7  125.09,61.28 0 top
U8  111.12,44.13 180 bottom
U$1  38.42,4.13 0 top
U$5  3.81,3.81 0 top
U$6  189.55,30.48 270 top
U$7  199.39,3.81 0 top
U$8  3.81,92.71 0 top
U$9  0,-1.59 0 top
U$11  199.39,92.71 0 top
U$12  -0.95,-2.86 0 top
U$13  114.3,80.01 0 bottom
U$14  114.3,19.05 0 bottom
U$16  -1.91,-4.13 0 top  (outside the outline)
U$17  -2.86,-5.4 0 top  (outside the outline)
U$20  55.88,18.1 0 top
Y1  158.75,30.8 0 top
Y2  179.71,61.59 0 top

### Tracks (layer width: path | path; a pad name or v marks a point on that pad's centre or on a via)
!INT
  Top 0.254: U3.78 178.69,45.66 179.71,46.67 U4.12
!RX0BF
  Top 0.254: U4.11 178.44,47.62 178.12,47.31 172.4,47.31 171.45,48.26 166.29,48.26 U3.1
!RX1BF
  Top 0.254: U4.10 177.12,48.51 172.15,48.51 171.77,48.9 167.32,48.9 166.37,49.85 165.74,49.85 165.54,49.65 U3.2
!XRS
  Top 0.254: U3.9 162.04,49.84
  Top 0.406: 162.04,49.84 R14.2
+3V3  (via drill 0.33)
  Top 0.254: 121.6,73.98 122.87,73.98 123.39,73.46 LED0.A 123.39,69.33 125.09,67.63 U7.5 125.09,61.59 124.78,61.28 123.51,61.28 123.19,60.96 123.19,58.1 125.73,55.56 127.64,55.56 146.69,36.51 154.62,36.51 155.26,35.88 | 121.6,73.98 120.33,73.98 119.9,73.55 LED1.A | R1.1 121.6,73.98 | L1.2 v172.09,38.42 172.16,38.34 R9.B | 188.15,33.15 U$6.5 | U3.12 160.54,46.4 160.34,46.2 | v169.1,28.26 169.1,28.38 R11.B
  Top 0.406: C7.1 150.81,60.96 149.86,61.91 147.32,61.91 145.41,63.82 RIDER_DISPLAY.2 | U5.3 149.72,58.92 150.07,59.27 C7.1 | U6.3 183.38,65.44 C6.1 183.41,64.67 182.88,64.14 174.31,64.14 173.35,63.18 173.35,54.29 | C7.1 154.62,59.27 154.62,54.29 | 158.12,54.29 158.75,53.66 L2.2 R14.1 | 158.12,54.29 154.62,54.29 | R5.1 165.42,53.66 164.78,54.29 | 164.78,54.29 158.12,54.29 | 154.62,54.29 154.62,48.58 157,46.2 160.34,46.2 163.03,46.2 164.47,44.77 164.47,38.1 163.83,37.47 156.84,37.47 155.26,35.88 155.26,34.61 154.62,33.97 153.03,33.97 152.4,33.34 152.4,29.21 153.35,28.26 v169.1,28.26 176.53,28.26 183.83,20.95 191.77,20.95 192.72,21.91 192.72,32.38 192.09,33.02 U$6.5 | U4.18 187.32,52.39 185.42,54.29 173.35,54.29 | 173.35,54.29 164.78,54.29 | U4.18 189.15,48.55 C10.1 | U4.18 187.32,45.72 177.8,36.2 v172.09,36.2
  Top 0.61: RIDER_DISPLAY.2 145.41,78.42 U1.P$3 | RIDER_CONTROLS.6 148.27,90.17 145.73,87.63 145.73,83.82 U1.P$3 | U1.P$3 149.59,81.28 | 149.59,81.28 D4.A | C9.+ 149.59,81.28
  Bottom 0.406: R2.1 169.52,27.84 v169.1,28.26 168.68,27.84 R8.2 | v172.09,36.2 v172.09,38.42
+5V
  Top 0.61: C15.+ U2.P$3 | RIDER_DISPLAY.1 147.96,75.56 150.18,77.79 158.75,77.79 U2.P$3 | U2.P$3 160.29,81.28 D3.A
+12V  (via drill 0.33)
  Top 0.61: C13.+ U2.P$1 | U1.P$1 148.59,86.36 | 150.5,86.04 150.18,86.36 | 153.54,84.58 153.99,84.14
  Top 0.813: U1.P$1 150.18,86.36 C8.+ 153.54,84.58 | U2.P$1 160.29,86.36 D3.C 158.07,84.14 153.99,84.14 | D4.C 150.5,86.04 | 114.3,87.31 120.97,93.98 129.54,93.98 137.16,86.36 v143.83,86.36
  Top 1.016: HORN.P$1 6.53,23.32 7.62,22.23 11.43,22.23 12.53,23.32 HORN.P$3 23.56,25.14 23.81,25.4 | AUX1_12VG.3 24.77,69.85 23.5,71.12 | 23.5,71.12 20.64,73.98 12.38,73.98 11.03,75.33 IND.P$1 | 23.5,71.12 43.5,71.12 45.09,69.53 MAIN_PRE_12.1 | PRE.P$1 57.33,21.1 58.51,19.91
  Top 2.54: AUX2_12VG.3 24.77,26.35 23.81,25.4 23.81,18.41 27.62,14.61 53.2,14.61 58.51,19.91 58.91,20.32 99.69,20.32 106.05,26.67 | 106.05,26.67 106.05,86.68 108.27,88.9 112.71,88.9 114.3,87.31 U$13.2 | U$14.2 114.3,26.67 | 106.05,26.67 114.3,26.67 | 114.3,26.67 140.02,26.67 140.02,15.05 CANA_THROTTLE.14 CANA_THROTTLE.13
  Bottom 0.813: U1.P$1 v143.83,86.36
  Bottom 2.54: AUX2_12VG.3 AUX1_12VG.3
  pour Top (no thermals): 32.7,61.59 23.81,61.59 23.81,68.58 26.04,68.58 26.04,64.45 32.7,64.45
AUX1_C_12_G
  Top 1.016: AUX1.P$2 9.53,69.85 10.79,71.12 20.64,71.12 22.23,69.53 AUX1_12VG.2 22.23,53.34 23.81,51.75 45.4,51.75 46.8,50.35 SW_IND.4
AUX1_NONC
  Top 1.016: AUX1_NONC.2 9.53,53.02 14.1,48.45 SW_IND.5
AUX2_C_12_G
  Top 1.016: AUX2.P$2 34.61,32.26 | 34.61,32.26 SW_IND.14 | AUX2_12VG.2 22.23,31.11 23.37,32.26 34.61,32.26
AUX2_NONC
  Top 1.016: AUX2_NONC.2 34.61,17.78 35.56,16.83 41.91,16.83 42.86,17.78 42.86,33.02 46.8,36.96 SW_IND.13
AUX_BUS+12
  Top 2.54: AUX_BUS.P$2 34.92,59.69 37.78,56.83 46.04,56.83 50.8,52.07 SW_IND.3
BTN  (via drill 0.33)
  Top 0.254: BTN.3 128.91,79.38 127.32,77.79 127.32,68.9 128.91,67.31 128.91,58.42 133.67,53.66 v143.19,53.66 | v145.73,53.66 149.22,53.66 151.13,55.56 v153.67,55.56 | v155.57,55.56 v165.42,55.56 | U3.79 166.37,46.16 166.37,46.99 166.8,47.42 v168.91,47.42 | R5.2 166.27,50.9 167.32,49.85 v168.91,49.85
  Bottom 0.254: v143.19,53.66 v145.73,53.66 | v153.67,55.56 v155.57,55.56 | v165.42,55.56 R5.2 | v168.91,47.42 v168.91,49.85
  other vias: 165.42,50.9
CAN_!CS
  Top 0.254: U4.16 184.78,46.67 182.27,44.16 U3.75
CAN_!RST
  Top 0.254: U4.17 186.06,46.67 176.54,37.16 U3.61
CAN_SCK
  Top 0.254: U3.77 179.78,45.16 180.97,46.35 U4.13
CAN_SI
  Top 0.203: 179.07,47.31 179.07,49.53
  Top 0.254: U3.80 178.42,46.66 179.07,47.31 | 179.07,49.53 179.71,50.16 181.93,50.16 182.25,49.85 U4.14
CAN_SO
  Top 0.254: U4.15 183.51,46.99 181.19,44.66 U3.76
CANH_2
  Top 0.406: U$13.5 115.16,77.98 117.35,77.98 120.33,80.96 133.99,80.96 140.34,74.61 RIDER_DISPLAY.4 140.34,64.45 138.11,62.23 138.11,58.74 139.2,57.65 U5.7
  Bottom 0.406: U$14.5 112.3,47.31 | 112.3,47.31 U$13.5 | 112.3,47.31 112.12,47.13 U8.2
CANH_A
  Top 0.406: RIDER_CONTROLS.5 184.47,87.63 182.11,85.27 U6.7 182.11,72.53 182.56,72.07 188.59,72.07 193.68,66.99 193.68,21.59 192.09,20 182.56,20 175.9,26.67 157.8,26.67 157.1,25.97 CANA_THROTTLE.5 157.1,21.05 CANA_THROTTLE.9
CANL_2
  Top 0.406: U5.6 139.2,58.92 139.06,59.05 139.06,61.91 141.6,64.45 142.24,64.45 142.88,65.09 RIDER_DISPLAY.3 142.88,73.66 134.3,82.23 120.02,82.23 117.79,80.01 U$13.4
  Bottom 0.406: U$13.4 116.3,50.16 | 116.3,50.16 116.3,49.21 116.84,48.58 116.84,39.69 116.2,39.05 U$14.4 | R10.1 116.3,50.16
CANL_A
  Top 0.406: RIDER_CONTROLS.4 185.42,85.09 183.38,83.05 183.38,77.15 | U6.6 183.38,77.15 | 183.38,77.15 185.42,77.15 186.37,76.2 186.37,74.61 187.64,73.34 188.59,73.34 194.63,67.31 194.63,21.27 192.41,19.05 182.25,19.05 175.58,25.72 161.93,25.72 161.1,24.89 CANA_THROTTLE.4 161.1,21.05 CANA_THROTTLE.8
GND  (via drill 0.33)
  Top 0.254: U3.73 166.67,43.16 v166.05,42.86 | U3.71 166.62,42.16 166.05,42.55 | U3.21 153.05,46.66 153.03,46.67 | U3.22 152.72,46.16 v152.72,46.35
  Top 2.54: U$13.7 114.3,71.44 109.22,71.44 | U$14.7 114.3,7.62
  other vias: 108.58,71.75 103.5,71.75 108.58,65.41 108.58,59.69 108.58,55.56 108.58,52.39 108.58,49.53 103.5,65.41 103.5,60.01 103.5,55.56 103.5,52.39 103.5,49.53 103.5,46.35 103.5,42.86 103.5,39.37 103.5,35.88 103.5,32.38 108.27,39.05 108.27,35.88 108.27,32.38 103.5,28.26 108.27,29.21 106.68,24.13 117.79,68.26 117.79,65.41 117.79,59.69 117.79,55.88 117.79,52.39 117.79,49.53 108.58,44.45 118.11,44.45 118.11,39.37 117.47,36.2 117.47,32.7 117.47,29.53 120.33,12.06 118.43,10.79 115.89,10.79 113.35,10.79 138.75,56.52 150.81,57.47 123.51,87.95 129.54,75.56 125.09,58.74 181.61,65.72 175.26,62.55 183.83,60.64 180.66,76.83 172.09,42.55 172.09,40.32 161.29,41.91 163.19,52.7 156.53,52.7 189.23,46.67 110.81,10.79 108.27,10.79 106.68,12.06 164.78,30.16 154.62,32.07 162.88,30.16 169.23,32.7 150.81,38.73 140.65,49.85 174.62,42.55 162.56,33.34 106.68,21.91 106.68,19.68 106.68,17.46 106.68,15.24
  pour Top (rank 2): 0,96.52 203.2,96.52 203.2,0 0,0
  pour Bottom: 0,96.52 0,0 203.2,0 203.2,96.52
GPIO34
  Top 0.254: U3.74 172.88,43.66 173.35,43.18 173.35,40.64 173.6,40.4 R9.A
HORN_12V
  Top 1.016: HORN.P$2 9.53,35.24 18.73,44.45 SW_IND.9
HV_IND
  Top 0.406: IND.P$3 17.52,87.25 18.73,86.04 D5.C D1.C
IND_1
  Top 0.406: IND2.P$1 87.22,74.53 85.72,73.03 80.33,73.03 76.52,69.22 76.52,54.29 73.66,51.44 58.1,51.44 56.83,50.16 56.83,47.31 55.56,46.23 54.93,46.23 SW_IND.7
IND_2  (via drill 0.6)
  Top 0.406: IND2.P$3 87.22,85.32 85.72,83.82 85.72,75.25 84.77,74.3 79.69,74.3 75.25,69.85 75.25,54.93 73.03,52.7 v58.1,52.7 | v53.02,52.7 52.83,52.39 52.83,47.31 51.44,46.23 51.02,46.23 SW_IND.8
  Bottom 0.406: v53.02,52.7 v58.1,52.7
JTAG_!TRST  (via drill 0.33)
  Top 0.254: U3.10 161.54,47.06 v161.61,46.99 | U$6.2 190.82,44.35 R15.1 190.72,48.68 v188.28,51.12 | v186.37,51.12 168.28,51.12 v167.96,50.8
  Bottom 0.254: v188.28,51.12 v186.37,51.12 | v161.61,46.99 164.47,49.85 167,49.85 v167.96,50.8
JTAG_TCK
  Top 0.254: U$6.9 U$6.11 183.2,25.4 179.07,29.53 166.69,29.53 166.05,30.16 166.05,32.38 164.54,33.9 U3.57
JTAG_TDI
  Top 0.254: U3.59 165.54,34.17 165.74,33.97 179.71,33.97 181.29,35.56 U$6.3
JTAG_TDO
  Top 0.254: U3.58 165.04,34.03 166.82,32.25 166.82,31.3 167.57,30.55 R11.A 178.72,30.55 179.39,31.22 179.39,32.25 184.28,32.25 186.06,30.48 U$6.7
JTAG_TMS
  Top 0.254: U3.60 166.3,35.31 166.69,34.92 179.71,34.92 182.88,38.1 U$6.1
LED0
  Top 0.254: U3.34 146.21,40.16 126.14,60.23 U7.3
LED1
  Top 0.254: U3.39 147.76,37.66 127.95,57.47 125.09,57.47 124.14,58.42 U7.1
MAIN_CONT
  Top 0.406: 55.72,53.18 55.56,53.02 | D5.A 24.13,86.04 24.77,85.41 24.77,78.74 29.21,74.3 57.47,74.3 60.33,71.44 MAIN.P$2
  Top 1.016: MAIN.P$2 60.33,57.78 55.72,53.18 | SW_IND.2 54.8,52.26 55.56,53.02
N$1
  Top 0.406: U4.8 178.44,59.87 Y2.1 175.56,60.45 C3.1
N$2
  Top 0.406: U4.7 179.71,61.91 180.54,62.74 Y2.3 183.53,62.74 C2.1
N$3
  Top 1.016: AUX1.P$1 6.53,58.24 AUX1_NONC.1
N$4
  Top 0.406: JP5.2 187.32,64.14 188.59,65.41 188.59,70.17 187.64,71.12 181.29,71.12 180.84,70.67 U6.1 179.45,68.54 R4.1
N$5
  Top 1.016: AUX1.P$3 12.53,58.24 AUX1_NONC.3
N$6
  Top 0.254: U3.20 C1.1 L2.1
N$7
  Top 0.254: U7.4 126.05,64.23 R18.2
N$8
  Top 1.016: AUX2.P$1 31.61,20.78 AUX2_NONC.1
N$9
  Top 0.254: U7.6 124.14,64.23 R3.2
N$10
  Top 1.016: AUX2.P$3 37.61,20.78 AUX2_NONC.3
N$11
  Bottom 0.406: U8.3 113.33,50.04 R10.2
N$12
  Top 1.016: MAIN.P$1 48.2,63.24 47.62,63.82 MAIN_PRE_12.2
N$13  (via drill 0.33)
  Top 0.254: 169.23,41.27 168.84,41.66 U3.70 165.8,41.66 165.42,41.27 v165.42,40.71 | v163.51,40.64 162.03,39.16 U3.36 152.62,39.16 C18.1
  Top 0.406: 169.23,41.27 169.23,40.64 169.54,40.32 C19.1 L1.1
  Bottom 0.254: v165.42,40.71 163.58,40.71 v163.51,40.64
N$14  (via drill 0.33)
  Top 0.254: RESET.3 126.68,84.14 v126.68,83.5 | R1.2 125.63,78.32 v126.68,79.38 126.05,78.74 126.05,69.22 127.64,67.63 v127.64,60.33 | v127.64,56.52 146.99,37.16 U3.40
  Bottom 0.254: v126.68,83.5 v126.68,79.38 | v127.64,56.52 v127.64,60.33
N$15
  Bottom 0.406: R2.2 170.5,24.45 CANA_THROTTLE.2
N$16
  Bottom 0.406: R6.2 CANA_THROTTLE.3
N$17
  Top 0.406: CANA_THROTTLE.11 169.1,11.46 R7.1
N$18
  Bottom 0.406: CANA_THROTTLE.7 167.1,26.04 R8.1
N$19
  Top 0.254: U3.54 163.04,34.13 165.1,32.07 C16.1
N$20
  Top 0.254: U3.7 163.04,50.75 C20.1
N$21
  Top 0.254: U3.72 170.17,42.66 C21.1
N$22
  Top 0.254: LED1.C 121.4,70.05 123.83,67.63 R3.1
N$27
  Top 0.254: LED0.C 124.89,69.1 126.36,67.63 R18.1
PRECHARGE
  Top 0.406: D1.A 23.23,78.69 28.89,73.03 48.58,73.03 50.16,71.44 MAIN_PRE_12.3
  Top 1.016: PRE.P$2 60.33,31.11 57.78,33.66 52.07,33.66 50.8,34.92 SW_IND.12
  Bottom 1.016: SW_IND.12 50.8,38.42 49.21,36.83 40.32,36.83 38.73,38.42 38.73,50.8 40.01,52.07 46.99,52.07 50.16,55.24 MAIN_PRE_12.3
RELAY+
  Bottom 0.406: U$13.3 107.95,81.66 107.95,74.3 108.9,73.34 110.49,73.34 111.12,72.71 111.12,50.48 107.92,47.28 U8.1
RELAY-
  Bottom 0.406: U$14.6 118.3,13.21 117.16,12.06 109.22,12.06 107.92,13.36 107.95,13.38 107.95,24.13 109.54,25.72 110.49,25.72 111.12,26.35 111.12,37.78 107.95,40.96 107.92,40.98 U8.8
RXCAN0
  Top 0.254: U3.33 151.75,40.66 144.15,48.26 144.15,58.74 145.6,60.19 U5.4
RXCAN1
  Top 0.406: U6.4 184.65,66.49 185.42,65.72 185.42,61.28 186.06,60.64 U4.2
SHIELD  (1 unrouted)
  Top 1.016: 135.57,95.25 6.35,95.25 U$8.P$1 1.59,90.49 1.59,6.03 U$5.P$1 6.03,1.59 101.28,1.59 | 135.57,95.25 196.85,95.25 RIDER_CONTROLS.S3 201.61,90.49 201.61,74.93 | 201.61,74.93 201.61,66.99 | 201.61,66.99 201.61,6.03 RIDER_DISPLAY.8 197.17,1.59 173.04,1.59 | 173.04,1.59 121.92,1.59 | 121.92,1.59 101.28,1.59 | U$14.1 121.92,19.43 121.92,1.59 | RIDER_DISPLAY.7 100.97,1.91 101.28,1.59 | RIDER_DISPLAY.9 201.29,67.31 201.61,66.99 | RIDER_CONTROLS.S2 201.61,74.93 | RIDER_CONTROLS.S4 135.57,95.25 | CANA_THROTTLE.10 173.1,1.65 173.04,1.59
  Bottom 0.61: U$13.1 118.3,92.9 120.65,95.25 133.03,95.25 RIDER_CONTROLS.S4
START_GND
  Top 1.016: SW_IND.1 76.71,48.45 82.72,54.47 START_SW.P$1 82.72,64.63 83.82,65.72 87.63,65.72 | START_SW.P$3 88.72,64.63 87.63,65.72 | START_GND.2 88.58,72.39 87.63,71.44 87.63,65.72
START_NO
  Top 1.016: SW_IND.6 78.11,44.45 85.72,52.07 START_SW.P$2
STOP_COM
  Top 1.016: SW_IND.10 58.8,38.67 60.64,36.83 65.72,36.83 69.53,33.02 83.82,33.02 85.72,31.11 STOP.P$2
STOP_NC
  Top 0.406: 82.66,25.08 STOP.P$1
  Top 1.016: 82.66,25.08 72.71,25.08 69.85,27.94 69.85,29.84 65.09,34.61 60.01,34.61 58.74,35.88 55.56,35.88 54.8,36.64 SW_IND.11
THROTTLE1
  Top 0.406: RIDER_CONTROLS.3 194.31,82.55 196.53,81.28 196.53,20.64 193.04,17.14 180.02,17.14 178.12,19.05 CANA_THROTTLE.6
THROTTLE2
  Top 0.406: RIDER_CONTROLS.2 193.68,80.01 195.58,79.06 195.58,20.95 192.72,18.1 180.34,18.1 175.39,23.05 CANA_THROTTLE.1
TXCAN0
  Top 0.254: U3.32 152.2,41.16 144.78,48.58 144.78,55.56 145.6,56.38 U5.1
TXCAN1
  Top 0.406: U4.1 JP5.1
X1
  Top 0.254: U3.52 162.04,33.77 160.6,32.33 Y1.3 160.62,31.96 C4.1
X2
  Top 0.254: U3.51 161.54,34.22 161.29,33.97 159.38,33.97 158.75,33.34 158.75,30.8 157.6,29.65 Y1.1 155.24,29.65 C5.1

### Text on the board
tPlace: IND2 | IND | G | + | + | P | AUX1 | AUX_BUS | MAIN | START | HORN | AUX2 | PRE | STOP | G | + | Rider Display Backplane | And CAN mirror | V1.3
tNames: D5 | D1 | D4 | D3 | U6 | U5 | U3
bNames: U1 | U2 | U8